# EAGLE design RS232Breakout (EAGLE 6.5.0)
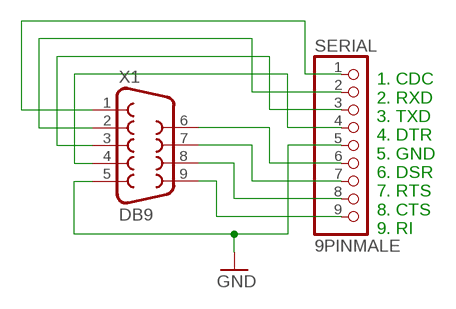
[diagram p0: schematic, sheet 1]

## Parts
SERIAL  9PINMALE  PINHD-1X9  [1X09]
X1  DB9  F09HP  [F09HP]

## Nets
GND: SERIAL.5 X1.5
N$24: SERIAL.9 X1.9
N$25: SERIAL.8 X1.8
N$26: SERIAL.7 X1.7
N$27: SERIAL.6 X1.6
N$29: SERIAL.4 X1.4
N$30: SERIAL.3 X1.3
N$31: SERIAL.2 X1.2
N$32: SERIAL.1 X1.1

## Notes on the sheet
- 1. CDC
  2. RXD
  3. TXD
  4. DTR
  5. GND
  6. DSR
  7. RTS
  8. CTS
  9. RI

## Library data of the parts
SERIAL = pinhead:PINHD-1X9: PIN HEADER
X1 = con-subd:F09: SUB-D; OC_FARNELL: unknown; OC_NEWARK: unknown

## Board
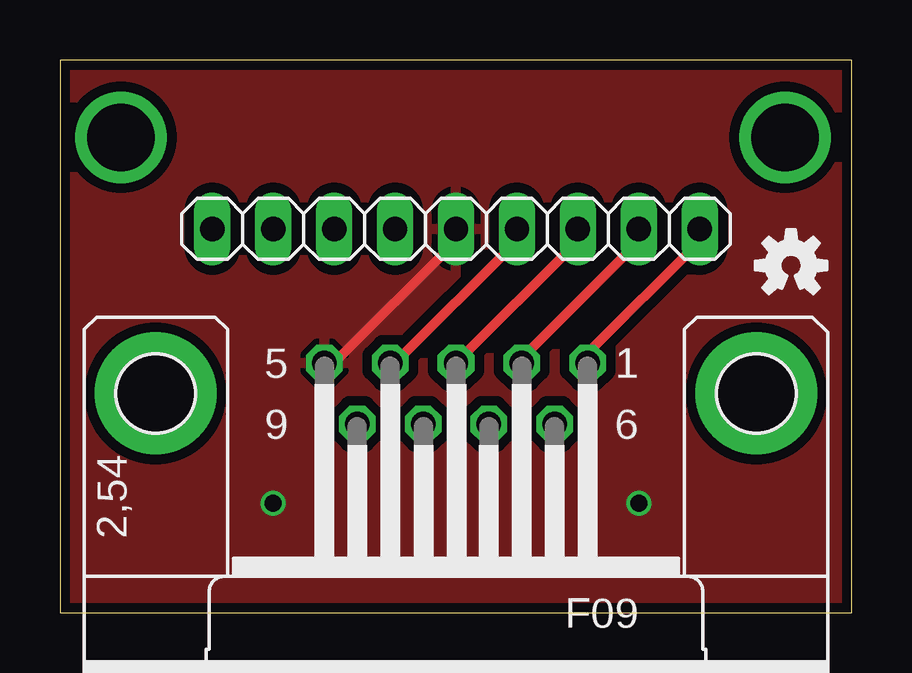
[diagram p1: board, top side]
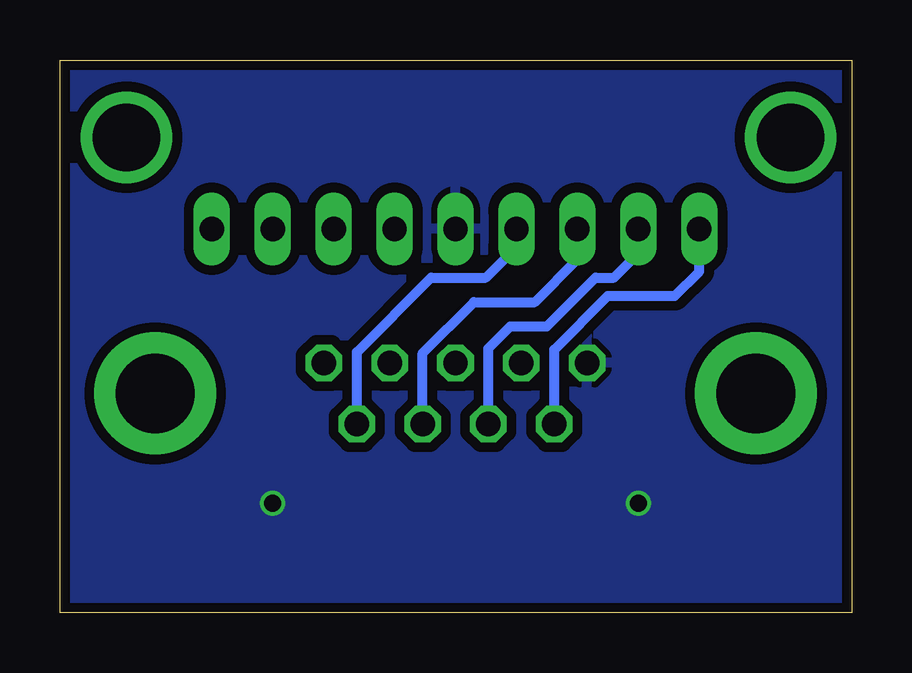
[diagram p2: board, bottom side, seen from below]

Size 33 x 23.04 mm. Coordinates in mm from the lower left corner, seen from the top.
Outline: 0,0 33,0 33,23.04 0,23.04 0,0
Copper layers (1*16): Top 0.035mm / dielectric 1.5mm / Bottom 0.035mm
Design rules "SeeedStudio_2layer_DRU_no_angle_20140221": minimum track width 6mil, minimum drill 12mil, track to track 6mil, track to pad 6mil, pad to pad 6mil, via to via 6mil, smd to smd 0mil, copper to edge 10mil, drill to drill 10mil, minimum pad ring 10mil, minimum via ring 6mil, stop-mask expansion 2mil, vias tented up to drill 100mil, thermal gap 10mil

### Footprints (pad centres in the part's own frame; a part is rotated, then mirrored left to right if it is on the bottom)
1X09 = drill 1.016 long: 1 -10.16,0; 2 -7.62,0; 3 -5.08,0; 4 -2.54,0; 5 0,0; 6 2.54,0; 7 5.08,0; 8 7.62,0; 9 10.16,0
F09HP = drill 1.016 octagon: 1 -5.486,-1.27; 2 -2.743,-1.27; 3 0,-1.27; 4 2.743,-1.27; 5 5.486,-1.27; 6 -4.115,1.27; 7 -1.372,1.27; 8 1.372,1.27; 9 4.115,1.27 | drill 3.302 pad 5.08: G1 -12.522,0; G2 12.522,0

### Placement (x,y rotation side)
SERIAL  16.51,16 180 top
U$4  [OSHW-LOGO-S]  30.48,14.48 0 top
X1  16.51,9.14 180 top

### Tracks (layer width: path | path; a pad name or v marks a point on that pad's centre or on a via)
GND  (via drill 0.7)
  Top 0.406: X1.5 11.43,10.41 16.51,15.49 SERIAL.5
  other vias: 8.89,4.57 24.13,4.57
  pour Bottom (isolate 0.406): 0,23.11 33.02,23.11 33.02,0 0,0
  pour Top (isolate 0.406): -0.76,23.11 33.02,23.11 33.02,0 -0.76,0
N$1  (via drill 2.8)
  other vias: 2.54,19.81
N$2  (via drill 2.8)
  other vias: 30.23,19.81
N$24
  Bottom 0.406: X1.9 12.39,10.97 10.16,13.21 7.37,13.21 6.35,14.22 SERIAL.9
N$25
  Bottom 0.406: X1.8 15.14,11.02 14.22,11.94 12.7,11.94 10.67,13.97 9.91,13.97 8.89,14.99 SERIAL.8
N$26
  Bottom 0.406: X1.7 17.88,10.82 15.75,12.95 13.21,12.95 11.43,14.73 SERIAL.7
N$27
  Bottom 0.406: X1.6 20.62,10.87 17.53,13.97 15.24,13.97 13.97,15.24 SERIAL.6
N$29
  Top 0.406: X1.4 13.97,10.41 19.05,15.49 SERIAL.4
N$30
  Top 0.406: X1.3 21.59,15.49 SERIAL.3
N$31
  Top 0.406: X1.2 19.25,10.62 24.13,15.49 SERIAL.2
N$32
  Top 0.406: X1.1 22,10.82 26.67,15.49 SERIAL.1

### Text on the board
tDocu: RI | CTS | RTS | DSR | GND | DTR | TXD | RXD | CDC | 9 | 8 | 7 | 6 | 5 | 3 | 4 | 2 | 1
bDocu: RS-232 breakout | noti, 2014